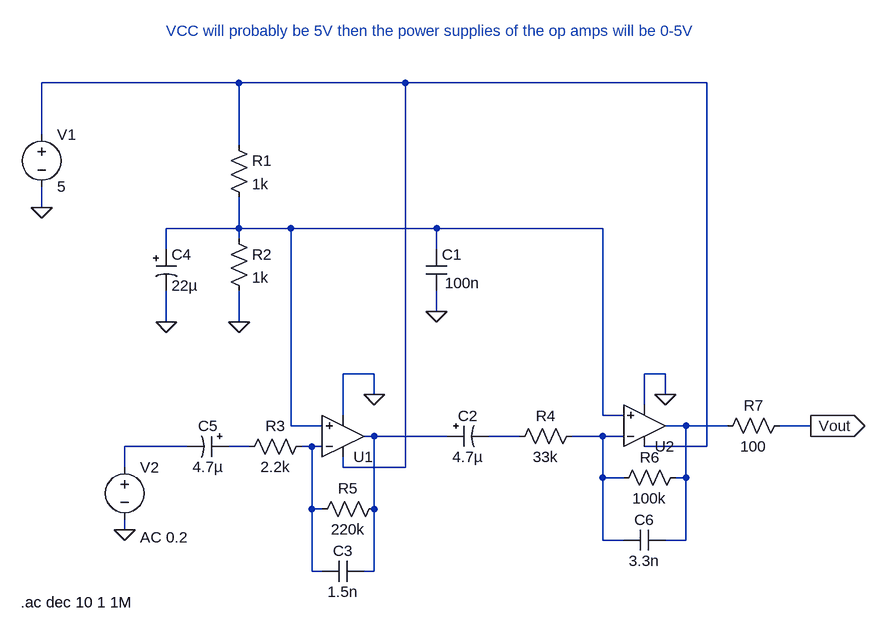
[diagram p0: schematic speed_sensor.asc]
speed_sensor.asc, the LTspice schematic file:
Version 4
SHEET 1 880 680
WIRE -192 -240 -496 -240
WIRE 64 -240 -192 -240
WIRE 528 -240 64 -240
WIRE -496 -160 -496 -240
WIRE -192 -144 -192 -240
WIRE -496 -48 -496 -80
WIRE -192 -16 -192 -64
WIRE -192 -16 -304 -16
WIRE -112 -16 -192 -16
WIRE 112 -16 -112 -16
WIRE 368 -16 112 -16
WIRE -192 0 -192 -16
WIRE -304 16 -304 -16
WIRE 112 16 112 -16
WIRE 112 112 112 80
WIRE -304 128 -304 80
WIRE -192 128 -192 80
WIRE 16 208 -32 208
WIRE 464 208 432 208
WIRE 16 240 16 208
WIRE 464 240 464 208
WIRE 432 256 432 208
WIRE -32 272 -32 208
WIRE 368 272 368 -16
WIRE 400 272 368 272
WIRE -112 288 -112 -16
WIRE -64 288 -112 288
WIRE 496 288 464 288
WIRE 560 288 496 288
WIRE 688 288 640 288
WIRE 16 304 0 304
WIRE 128 304 16 304
WIRE 240 304 192 304
WIRE 368 304 320 304
WIRE 400 304 368 304
WIRE -272 320 -368 320
WIRE -176 320 -208 320
WIRE -80 320 -96 320
WIRE -64 320 -80 320
WIRE 528 320 528 -240
WIRE 528 320 432 320
WIRE -368 352 -368 320
WIRE -32 352 -32 336
WIRE 64 352 64 -240
WIRE 64 352 -32 352
WIRE 368 368 368 304
WIRE 400 368 368 368
WIRE 496 368 496 288
WIRE 496 368 480 368
WIRE -80 416 -80 320
WIRE -64 416 -80 416
WIRE 16 416 16 304
WIRE -368 448 -368 432
WIRE 368 464 368 368
WIRE 400 464 368 464
WIRE 496 464 496 368
WIRE 496 464 464 464
WIRE -80 512 -80 416
WIRE -64 512 -80 512
WIRE 16 512 16 416
WIRE 16 512 0 512
FLAG -192 128 0
FLAG -304 128 0
FLAG 112 112 0
FLAG 688 288 Vout
IOPIN 688 288 Out
FLAG -496 -48 0
FLAG 16 240 0
FLAG 464 240 0
FLAG -368 448 0
SYMBOL OpAmps\\UniversalOpAmp -32 304 M180
SYMATTR InstName U1
SYMBOL res -208 -160 R0
SYMATTR InstName R1
SYMATTR Value 1k
SYMBOL res -208 -16 R0
SYMATTR InstName R2
SYMATTR Value 1k
SYMBOL res -80 304 R90
WINDOW 0 0 56 VBottom 2
WINDOW 3 32 56 VTop 2
SYMATTR InstName R3
SYMATTR Value 2.2k
SYMBOL cap 96 16 R0
WINDOW 3 29 52 Left 2
SYMATTR Value 100n
SYMATTR InstName C1
SYMBOL polcap -320 16 R0
SYMATTR InstName C4
SYMATTR Value 22µ
SYMBOL polcap -208 304 R90
WINDOW 0 0 32 VBottom 2
WINDOW 3 32 32 VTop 2
SYMATTR InstName C5
SYMATTR Value 4.7µ
SYMBOL polcap 128 288 M90
WINDOW 0 0 32 VBottom 2
WINDOW 3 32 32 VTop 2
SYMATTR InstName C2
SYMATTR Value 4.7µ
SYMBOL res 336 288 R90
WINDOW 0 0 56 VBottom 2
WINDOW 3 32 56 VTop 2
SYMATTR InstName R4
SYMATTR Value 33k
SYMBOL res 32 400 R90
WINDOW 0 0 56 VBottom 2
WINDOW 3 32 56 VTop 2
SYMATTR InstName R5
SYMATTR Value 220k
SYMBOL res 496 352 R90
WINDOW 0 0 56 VBottom 2
WINDOW 3 32 56 VTop 2
SYMATTR InstName R6
SYMATTR Value 100k
SYMBOL res 656 272 R90
WINDOW 0 0 56 VBottom 2
WINDOW 3 32 56 VTop 2
SYMATTR InstName R7
SYMATTR Value 100
SYMBOL OpAmps\\UniversalOpAmp 432 288 M180
SYMATTR InstName U2
SYMBOL cap 0 496 R90
WINDOW 0 0 32 VBottom 2
WINDOW 3 32 32 VTop 2
SYMATTR InstName C3
SYMATTR Value 1.5n
SYMBOL cap 464 448 R90
WINDOW 0 0 32 VBottom 2
WINDOW 3 32 32 VTop 2
SYMATTR InstName C6
SYMATTR Value 3.3n
SYMBOL voltage -496 -176 R0
WINDOW 123 0 0 Left 0
WINDOW 39 0 0 Left 0
SYMATTR InstName V1
SYMATTR Value 5
SYMBOL voltage -368 336 R0
WINDOW 123 24 124 Left 2
WINDOW 39 0 0 Left 0
SYMATTR Value2 AC 0.2
SYMATTR InstName V2
SYMATTR Value ""
TEXT -304 -320 Left 2 ;VCC will probably be 5V then the power supplies of the op amps will be 0-5V
TEXT -528 560 Left 2 !.ac dec 10 1 1M

The netlist it stands for:
* speed_sensor.asc
XU1 N002 N009 N001 0 N004 level1 Avol=1Meg GBW=10Meg Vos=0 En=0 Enk=0 In=0 Ink=0 Rin=500Meg  ; pins In+ In- V+ V- OUT
R1 N001 N002 1k
R2 N002 0 1k
R3 N009 N008 2.2k
C1 N002 0 100n
C4 N002 0 22µ
C5 N008 N007 4.7µ
C2 N004 N005 4.7µ
R4 N006 N005 33k
R5 N004 N009 220k
R6 N003 N006 100k
R7 Vout N003 100
XU2 N002 N006 N001 0 N003 level1 Avol=1Meg GBW=10Meg Vos=0 En=0 Enk=0 In=0 Ink=0 Rin=500Meg  ; pins In+ In- V+ V- OUT
C3 N004 N009 1.5n
C6 N003 N006 3.3n
V1 N001 0 5
V2 N007 0 AC 0.2
* VCC will probably be 5V then the power supplies of the op amps will be 0-5V
.ac dec 10 1 1M
.lib UniversalOpAmp1.lib
.backanno
.end